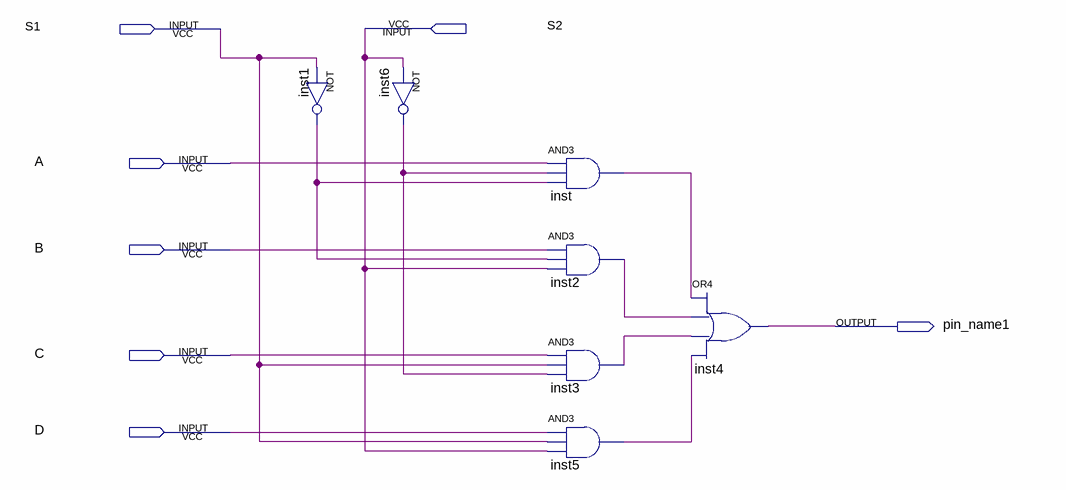
[diagram p0: schematic sheet]
// Quartus schematic FourWayOneBitMultiplexer.bdf as structural Verilog: 7 symbols, 7 pins
module FourWayOneBitMultiplexer (
  input  S1,
  input  S2,
  input  A,
  input  B,
  input  C,
  input  D,
  output pin_name1
);

  wire inst1_out, inst2_out, inst3_out, inst5_out, inst6_out, inst_out;

  not inst1 (inst1_out, S1);
  not inst6 (inst6_out, S2);
  and inst (inst_out, A, inst6_out, inst1_out);
  and inst2 (inst2_out, B, inst1_out, S2);
  and inst3 (inst3_out, C, S1, inst6_out);
  and inst5 (inst5_out, D, S1, S2);
  or inst4 (pin_name1, inst_out, inst2_out, inst3_out, inst5_out);
endmodule
